# EAGLE design Version0 (EAGLE 6.5.0)
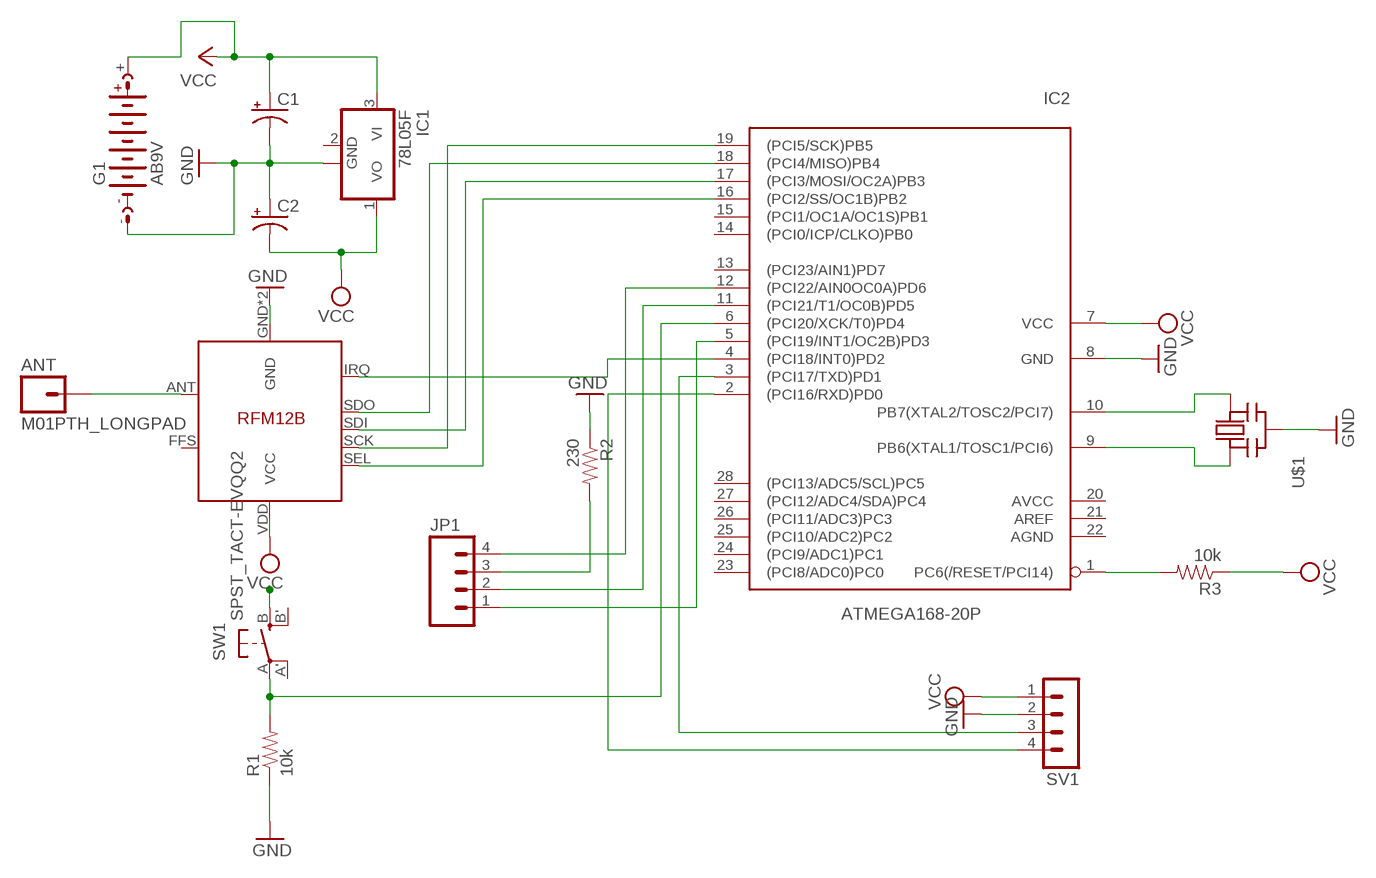
[diagram p0: schematic, sheet 1]

## Parts
ANT  M01PTH_LONGPAD  [1X01_LONGPAD]
C1  CAP_POLC  [PANASONIC_C]
C2  CAP_POLC  [PANASONIC_C]
G1  AB9V  [AB9V]
IC1  78L05F  [SOT89]
IC2  ATMEGA168-20P  [DIL28-3]
JP1  M04LOCK_LONGPADS  [1X04_LOCK_LONGPADS]
R1  10k  RESISTOR2512  [R2512]
R2  230  RESISTOR2512  [R2512]
R3  10k  RESISTOR2512  [R2512]
SV1  MA04-1  [MA04-1]
SW1  SPST_TACT-EVQQ2  [EVQ-Q2]
U$1  CERMOSCILL-CSTCRG  [CSTCR-G]
U$3  RFM12BRMF12BGND  [RFM12B]

## Nets
5V: C2.- IC1.1(VO) IC2.7(VCC) R3.1 SV1.1 SW1.B(S) U$3.VDD(VCC) ; supply symbol labelled VCC
GND: C1.- C2.+ G1.- IC1.2@1(GND) IC2.8(GND) R1.1 R2.1 SV1.2 U$1.2(GND) U$3.GND U$3.P$12(GND)
N$1: JP1.3 R2.2
N$2: IC2.9(PB6(XTAL1/TOSC1/PCI6)) U$1.1(IN)
N$3: IC2.4((PCI18/INT0)PD2) U$3.IRQ
N$4: IC2.16((PCI2/SS/OC1B)PB2) U$3.SEL
N$5: IC2.19((PCI5/SCK)PB5) U$3.SCK
N$6: IC2.17((PCI3/MOSI/OC2A)PB3) U$3.SDI
N$7: IC2.3((PCI17/TXD)PD1) SV1.3
N$8: IC2.11((PCI21/T1/OC0B)PD5) JP1.2
N$9: IC2.5((PCI19/INT1/OC2B)PD3) JP1.1
N$10: IC2.2((PCI16/RXD)PD0) SV1.4
N$12: IC2.12((PCI22/AIN0OC0A)PD6) JP1.4
N$13: IC2.10(PB7(XTAL2/TOSC2/PCI7)) U$1.3(OUT)
N$14: IC2.18((PCI4/MISO)PB4) U$3.SDO
N$15: IC2.6((PCI20/XCK/T0)PD4) R1.2 SW1.A(P)
N$16: ANT.1 U$3.ANT
N$30: IC2.1(PC6(/RESET/PCI14)) R3.2
VCCBAT: C1.+ G1.+ IC1.3(VI) ; supply symbol labelled VCC
Unconnected: IC1.2(GND) IC2.13((PCI23/AIN1)PD7) IC2.14((PCI0/ICP/CLKO)PB0) IC2.15((PCI1/OC1A/OC1S)PB1) IC2.20(AVCC) IC2.21(AREF) IC2.22(AGND) IC2.23((PCI8/ADC0)PC0) IC2.24((PCI9/ADC1)PC1) IC2.25((PCI10/ADC2)PC2) IC2.26((PCI11/ADC3)PC3) IC2.27((PCI12/ADC4/SDA)PC4) IC2.28((PCI13/ADC5/SCL)PC5) SW1.A'(P1) SW1.B'(S1) U$3.FFS

## Library data of the parts
ANT = SparkFun:M01: Header 1 Standard 1-pin 0.1" header. Use with straight break away headers (SKU : PRT-00116), right angle break away headers (PRT-00553), swiss pins (PRT-00743), machine pins (PRT-00117), and female headers (PRT-00115).
C1 C2 = SparkFun:CAP_POL: Capacitor Polarized These are standard SMD and PTH capacitors. Normally 10uF, 47uF, and 100uF in electrolytic and tantalum varieties. Always verify the external diameter of the through hole cap, it varies with capacity, voltage, and manufacturer. The EIA devices should be standard.
G1 = battery:AB9V: 9-V BATTERY CLIP
IC1 = linear:78L*: POSITOIV-VOLTAGE REGULATORS Output up to 100 mA Source: http://focus.ti.com/lit/ds/symlink/ua78l05.pdf
IC2 = adafruit:ATMEGA168*P: MICROCONTROLLER 16 kBytes FLASH 1 kBytes SRAM 512 Bytes EEPROM USART 8-channel 10 bit ADC
JP1 = SparkFun:M04: Header 4 Standard 4-pin 0.1" header. Use with straight break away headers (SKU : PRT-00116), right angle break away headers (PRT-00553), swiss pins (PRT-00743), machine pins (PRT-00117), and female headers (PRT-00115). Molex polarized connector foot print use with SKU : PRT-08231 with associated crimp pins and housings. 1MM SMD Version SKU: PRT-10208
R1-R3 = SparkFun:RESISTOR: Resistor Basic schematic elements and footprints for 0603, 1206, and PTH resistors.
SV1 = con-lstb:MA04-1: PIN HEADER; OC_FARNELL: unknown; OC_NEWARK: unknown
SW1 = adafruit:SPST_TACT: SMT 6mm switch, EVQQ2 series http://www.ladyada.net/library/eagle
U$1 = adafruit:CERMOSCILL: Ceramic oscillator with built in capacitors such as ZTT-12MHz http://www.ladyada.net/library/eagle
U$3 = JeeParts:RFM12B: GND pins connected

## Board
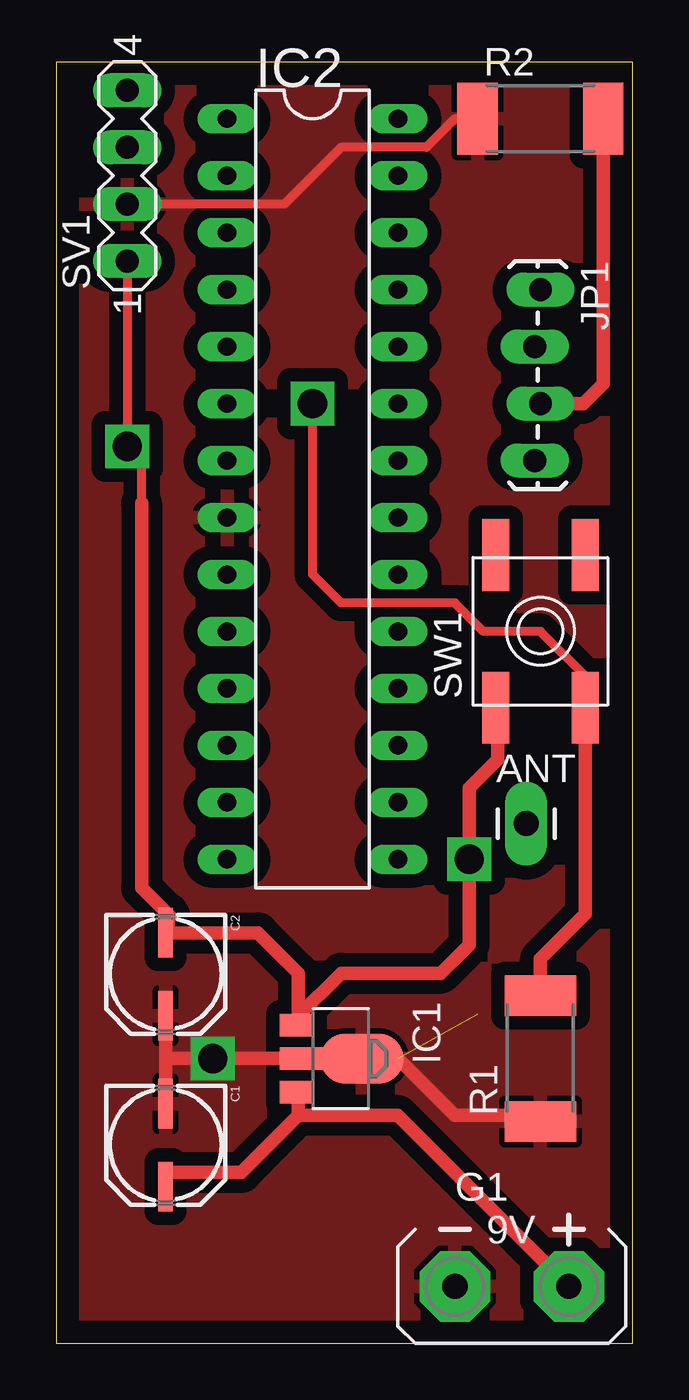
[diagram p1: board, top side]
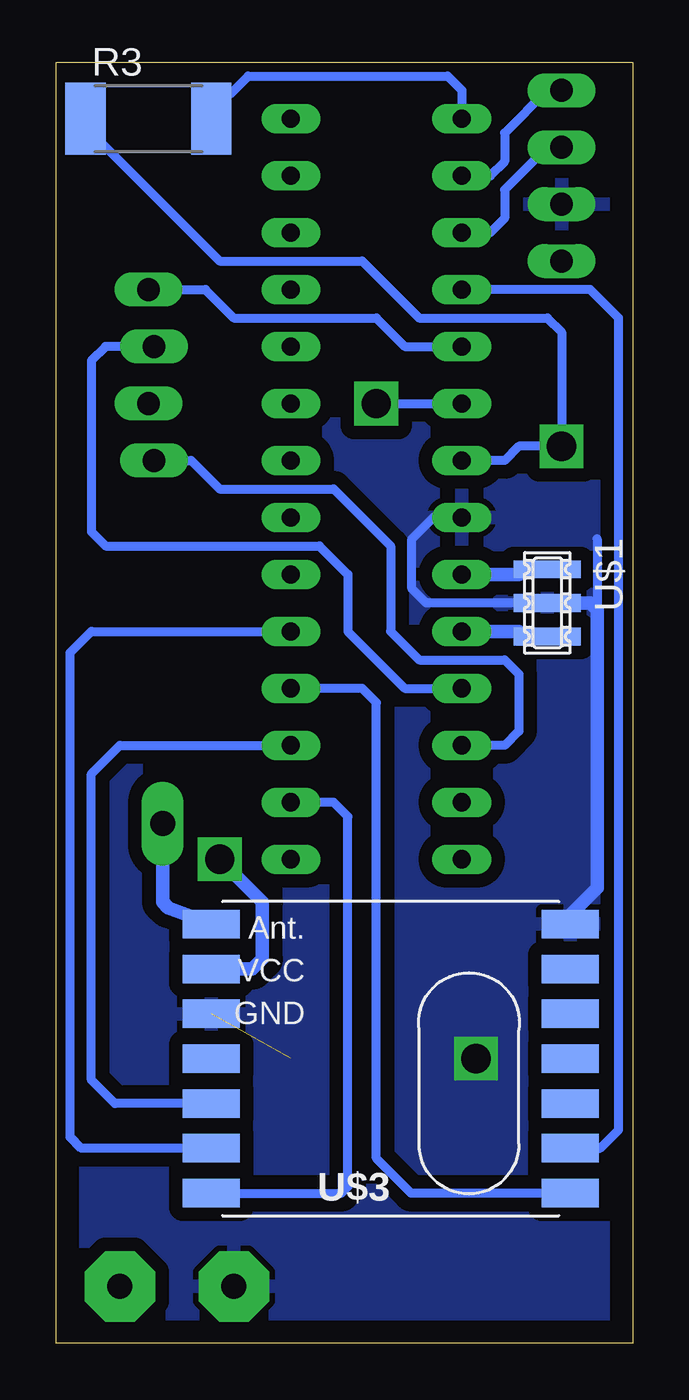
[diagram p2: board, bottom side, seen from below]

Size 25.7 x 57.14 mm. Coordinates in mm from the lower left corner, seen from the top.
Outline: 0,0 25.7,0 25.7,57.14 0,57.14 0,0
Copper layers (1*16): Top 0.035mm / dielectric 1.5mm / Bottom 0.035mm
Design rules "default": minimum track width 10mil, minimum drill 24mil, track to track 8mil, track to pad 8mil, pad to pad 8mil, via to via 8mil, smd to smd 8mil, copper to edge 40mil, drill to drill 8mil, minimum pad ring 10mil, minimum via ring 8mil, stop-mask expansion 4mil, vias tented up to drill 0mil, thermal gap 10mil

### Footprints (pad centres in the part's own frame; a part is rotated, then mirrored left to right if it is on the bottom)
1X01_LONGPAD = drill 1.118 pad 1.88 long: 1 0,0
PANASONIC_C = smd 2.2 x 0.65: + 1.9,-0.2; - -1.8,-0.2
AB9V = drill 1.118 pad 3.15 octagon: + 0,2.54; - 0,-2.54
SOT89 = smd 1 x 1.5: 1 -1.499,-1.981; 3 1.499,-1.981 | smd 1 x 2: 2 0,-1.727 | smd 2.2 x 3.7: 2@1 0,0.94
DIL28-3 = drill 0.813 long: 1 -16.51,-3.81; 2 -13.97,-3.81; 3 -11.43,-3.81; 4 -8.89,-3.81; 5 -6.35,-3.81; 6 -3.81,-3.81; 7 -1.27,-3.81; 8 1.27,-3.81; 9 3.81,-3.81; 10 6.35,-3.81; 11 8.89,-3.81; 12 11.43,-3.81; 13 13.97,-3.81; 14 16.51,-3.81; 15 16.51,3.81; 16 13.97,3.81; 17 11.43,3.81; 18 8.89,3.81; 19 6.35,3.81; 20 3.81,3.81; 21 1.27,3.81; 22 -1.27,3.81; 23 -3.81,3.81; 24 -6.35,3.81; 25 -8.89,3.81; 26 -11.43,3.81; 27 -13.97,3.81; 28 -16.51,3.81
1X04_LOCK_LONGPADS = drill 1.016 long: 1 0,0; 2 2.54,-0.254; 3 5.08,0; 4 7.62,-0.254
R2512 = smd 1.8 x 3.2: 1 -2.8,0; 2 2.8,0
MA04-1 = drill 1.016 long: 1 -3.81,0; 2 -1.27,0; 3 1.27,0; 4 3.81,0
EVQ-Q2 = smd 3.2 x 1.2: A -3.4,-2; A' 3.4,-2; B -3.4,2; B' 3.4,2
CSTCR-G = smd 0.8 x 3: 1 -1.5,0; 2 0,0; 3 1.5,0
RFM12B = smd 2.54 x 1.27: ANT 8,-6; FFS -8,2; GND 8,-2; IRQ -8,4; P$8 -8,0; P$9 -8,-2; P$10 -8,-4; P$12 -8,-6; P$16 8,0; SCK 8,4; SDI 8,2; SDO -8,6; SEL 8,6; VDD 8,-4

### Placement (x,y rotation side)
ANT  20.95,23.18 0 top
C1  5.08,8.89 270 top
C2  5.08,16.51 270 top
G1  20.32,2.54 270 top
IC1  12.7,12.7 270 top
IC2  11.43,38.1 270 top
JP1  21.59,46.99 270 top
R1  21.59,12.7 90 top
R2  21.59,54.61 0 top
R3  21.59,54.61 0 bottom
SV1  3.17,52.07 90 top
SW1  21.59,31.75 90 top
U$1  3.81,33.02 270 bottom
U$3  10.79,12.7 180 bottom

### Tracks (layer width: path | path; a pad name or v marks a point on that pad's centre or on a via)
5V  (via drill 0.6, 1.3)
  Top 0.406: 5.08,19.05 5.08,18.51 C2.- | SV1.1 v3.17,40.01 3.81,39.37 3.81,37.47
  Top 0.61: SW1.B 19.68,28.25 19.68,26.04 18.41,24.77 v18.41,21.59 18.41,17.78 17.14,16.51 12.7,16.51 10.72,14.53 IC1.1 10.79,14.28 10.79,16.51 8.99,18.31 C2.- | 3.81,37.47 3.81,20.32 5.08,19.05
  Bottom 0.406: R3.1 24.39,54.23 18.41,48.26 12.06,48.26 9.53,45.72 3.81,45.72 3.17,45.09 v3.17,40.01 5.08,40.01 5.71,39.37 IC2.7
  Bottom 0.61: U$3.VDD 16.95,16.7 16.51,17.14 16.51,19.68 v18.41,21.59
  other vias: 7.62,39.37
GND  (via drill 1, 1.3)  (1 unrouted)
  Top 0.406: R2.1 17.78,54.61 16.51,53.34 12.7,53.34 10.16,50.8 SV1.2
  Top 0.61: R1.1 21.59,10.16 17.78,10.16 15.24,12.7 IC1.2@1 v6.99,12.7 4.88,12.7 | C2.+ 4.88,12.7 | 4.88,12.7 C1.-
  Bottom 0.406: U$1.2 9.21,33.02 9.84,33.66 9.84,35.88 8.89,36.83 IC2.8 | 1.59,35.88 1.59,29.84
  Bottom 0.61: U$3.P$12 2.79,19.11 1.59,20.32 1.59,29.84 1.59,32.7 1.91,33.02 U$1.2
  pour Top (isolate 0.61): 0,0 26.04,0 26.04,57.15 0,57.15
  pour Bottom (isolate 0.61): 0,0 0,57.15 25.4,57.15 25.4,0
N$1
  Top 0.61: R2.2 24.39,42.8 23.5,41.91 JP1.3
N$2
  Bottom 0.61: U$1.1 4.85,34.52 5.08,34.29 IC2.9
N$3
  Bottom 0.406: U$3.IRQ 1.46,8.7 0.64,9.53 0.64,45.72 1.91,46.99 IC2.4
N$4
  Bottom 0.406: U$3.SEL 12.98,6.7 12.7,6.99 12.7,23.5 13.34,24.13 IC2.16
N$5
  Bottom 0.406: U$3.SCK 24.57,8.7 25.08,9.21 25.08,30.8 24.13,31.75 IC2.19
N$6
  Bottom 0.406: U$3.SDI 23.08,10.7 24.13,11.75 24.13,25.4 22.86,26.67 IC2.17
N$7
  Bottom 0.406: SV1.3 3.81,53.34 5.71,51.44 5.71,50.16 6.35,49.53 IC2.3
N$8
  Bottom 0.406: JP1.2 23.5,44.45 24.13,43.81 24.13,36.2 23.5,35.56 13.97,35.56 12.7,34.29 12.7,31.75 10.16,29.21 IC2.11
N$9
  Bottom 0.406: JP1.1 19.05,46.99 17.78,45.72 11.43,45.72 10.16,44.45 IC2.5
N$10
  Bottom 0.406: SV1.4 3.81,55.88 5.71,53.98 5.71,52.7 6.35,52.07 IC2.2
N$12
  Bottom 0.406: JP1.4 19.68,39.37 18.41,38.1 13.34,38.1 10.79,35.56 10.79,31.75 9.53,30.48 5.71,30.48 5.08,29.84 5.08,27.3 5.71,26.67 IC2.12
N$13
  Bottom 0.61: IC2.10 5.08,31.75 4.85,31.52 U$1.3
N$14
  Bottom 0.406: U$3.SDO 9.88,6.7 11.43,8.26 11.43,28.57 12.06,29.21 IC2.18
N$15  (via drill 0.6, 1.3)
  Top 0.406: SW1.A 23.59,29.75 21.59,31.75 19.05,31.75 17.78,33.02 12.7,33.02 11.43,34.29 v11.43,41.91
  Top 0.61: R1.2 21.59,17.14 23.59,19.14 SW1.A
  Bottom 0.406: v11.43,41.91 IC2.6
N$16
  Bottom 0.61: U$3.ANT 20.7,19.43 20.95,19.68 ANT.1
N$30
  Bottom 0.406: R3.2 18.79,54.87 17.14,56.52 8.26,56.52 7.62,55.88 IC2.1
VCCBAT
  Top 0.61: C1.+ 4.88,7.42 5.08,7.62 8.26,7.62 10.79,10.16 | 10.79,10.16 10.79,11.12 IC1.3 | G1.+ 15.24,10.16 10.79,10.16